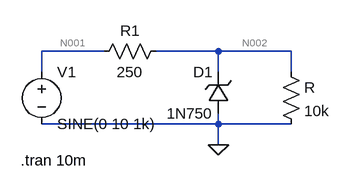
[diagram p0: schematic Draft3.asc]
Draft3.asc, the LTspice schematic file:
Version 4
SHEET 1 880 680
WIRE -144 64 -240 64
WIRE 32 64 -64 64
WIRE 144 64 32 64
WIRE -240 96 -240 64
WIRE 32 96 32 64
WIRE 144 96 144 64
WIRE 32 176 32 160
WIRE 32 176 -240 176
WIRE 144 176 32 176
WIRE 32 208 32 176
FLAG 32 208 0
SYMBOL zener 48 160 R180
WINDOW 0 24 64 Left 2
WINDOW 3 24 0 Left 2
SYMATTR InstName D1
SYMATTR Value 1N750
SYMBOL res -48 48 R90
WINDOW 0 0 56 VBottom 2
WINDOW 3 32 56 VTop 2
SYMATTR InstName R1
SYMATTR Value 250
SYMBOL voltage -240 80 R0
WINDOW 123 24 124 Left 2
WINDOW 39 0 0 Left 0
SYMATTR InstName V1
SYMATTR Value SINE(0 10 1k)
SYMBOL res 128 80 R0
SYMATTR InstName R
SYMATTR Value 10k
TEXT -272 232 Left 2 !.tran 10m

The netlist it stands for:
* Draft3.asc
D1 0 N002 1N750
R1 N002 N001 250
V1 N001 0 SINE(0 10 1k)
R N002 0 10k
.model D D
.lib standard.dio
.tran 10m
.backanno
.end

* Results of the author's LTspice run, read from the files saved beside the schematic
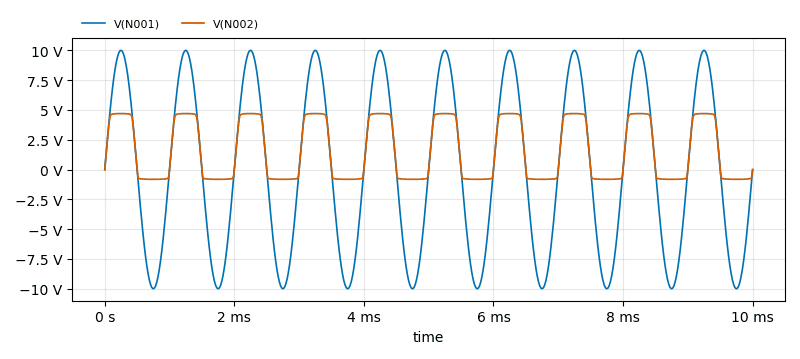
[diagram p1: Transient Analysis of Draft3.asc, plotted from the saved traces]
* Transient Analysis, 1 run:
*   V(N001): min -10 V, max 10 V, average 2.854 mV, rms 7.07 V, last 0 V
*   V(N002): min -817.8 mV, max 4.702 V, average 1.578 V, rms 2.978 V, last 3.776 mV